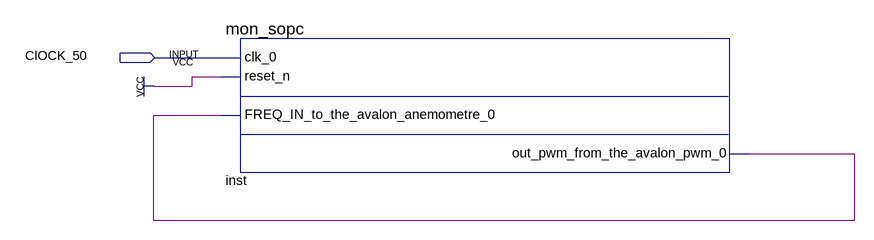
[diagram p0: schematic sheet]
// Quartus schematic sopc_cpmpteur.bdf as structural Verilog: 1 symbols, 1 pins
module sopc_cpmpteur (
  input  ClOCK_50
);

  wire inst_out_pwm_from_the_avalon_pwm_0;

  mon_sopc inst (
    .clk_0(ClOCK_50), .reset_n(1'b1),
    .FREQ_IN_to_the_avalon_anemometre_0(inst_out_pwm_from_the_avalon_pwm_0),
    .out_pwm_from_the_avalon_pwm_0(inst_out_pwm_from_the_avalon_pwm_0));
endmodule
